# Altium project cell_adapter.PrjPcb
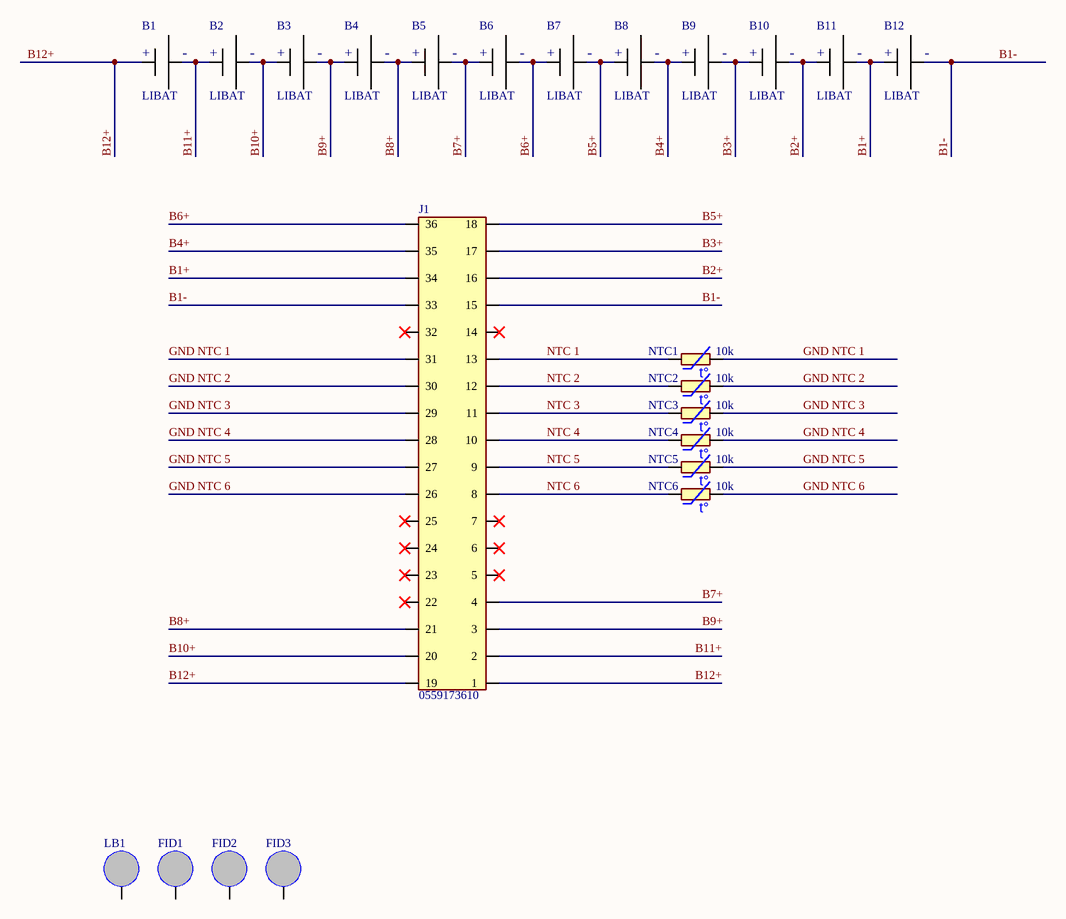
[diagram p0: cell_adapter.SchDoc]
1 sheet, 23 parts. Net scope: global (net labels, ports and power ports of the same name join across sheets).
Board file: cell_adapter.PcbDoc

## Sheet cell_adapter.SchDoc
size A4; SheetNumber: 1; SheetTotal: 1

### Parts
B1  LIBAT  [Li-BATTERY]
B2  LIBAT  [Li-BATTERY]
B3  LIBAT  [Li-BATTERY]
B4  LIBAT  [Li-BATTERY]
B5  LIBAT  [Li-BATTERY]
B6  LIBAT  [Li-BATTERY]
B7  LIBAT  [Li-BATTERY]
B8  LIBAT  [Li-BATTERY]
B9  LIBAT  [Li-BATTERY]
B10  LIBAT  [Li-BATTERY]
B11  LIBAT  [Li-BATTERY]
B12  LIBAT  [Li-BATTERY]
FID1  PE PAD  [FIDUCIAL]  (value not drawn)
FID2  PE PAD  [FIDUCIAL]  (value not drawn)
FID3  PE PAD  [FIDUCIAL]  (value not drawn)
J1  0559173610  [MICROFIT 36 VER]
LB1  PE PAD  [FIDUCIAL]  (value not drawn)
NTC1  10k  [NTC0805-HC]
NTC2  10k  [NTC0805-HC]
NTC3  10k  [NTC0805-HC]
NTC4  10k  [NTC0805-HC]
NTC5  10k  [NTC0805-HC]
NTC6  10k  [NTC0805-HC]

### Nets
B1+: B11.2 B12.1 J1.34
B1-: B12.2 J1.15 J1.33
B2+: B10.2 B11.1 J1.16
B3+: B9.2 B10.1 J1.17
B4+: B8.2 B9.1 J1.35
B5+: B7.2 B8.1 J1.18
B6+: B6.2 B7.1 J1.36
B7+: B5.2 B6.1 J1.4
B8+: B4.2 B5.1 J1.21
B9+: B3.2 B4.1 J1.3
B10+: B2.2 B3.1 J1.20
B11+: B1.2 B2.1 J1.2
B12+: B1.1 J1.1 J1.19
GND NTC 1: J1.31 NTC1.2
GND NTC 2: J1.30 NTC2.2
GND NTC 3: J1.29 NTC3.2
GND NTC 4: J1.28 NTC4.2
GND NTC 5: J1.27 NTC5.2
GND NTC 6: J1.26 NTC6.2
NTC 1: J1.13 NTC1.1
NTC 2: J1.12 NTC2.1
NTC 3: J1.11 NTC3.1
NTC 4: J1.10 NTC4.1
NTC 5: J1.9 NTC5.1
NTC 6: J1.8 NTC6.1

Not connected (* = marked no-connect by the designer): FID1 1; FID2 1; FID3 1; J1 5* 6* 7* 14* 22* 23* 24* 25* 32*; LB1 1

### Notes on the sheet
- Title:
- Size:
- Drawn By:
- Page Contents:
- Number:
- Checked By:
- Revision:
- Date:
- License:
- Email:
- Time:
- Sheet
- Website:
- of
- (in symbol LI-BATTERY) +; -
- (in symbol NTCS0805E3103FLT) t°

### Library data of the parts
B1-B12 = LI-BATTERY
FID1-FID3 LB1 = PE PAD: FIDUCIAL
J1 = Header 18X2: CONN HEADER VERT 36POS 2MM; Manufacturer_Name: Molex; Datasheet Link: https://www.molex.com/en-us/products/part-detail-pdf/559173610?display=pdf; Height: 9.95mm; Manufacturer_Part_Number: 0559173610
NTC1-NTC6 = NTCS0805E3103FLT: THERMISTOR NTC 10KOHM 3430K 0805; Manufacturer_Name: Vishay; Datasheet Link: http://www.vishay.com/docs/29044/ntcs0805e3t.pdf; Height: 0.95mm; Manufacturer_Part_Number: NTCS0805E3103FLT; Mouser Part Number: 594-NTCS0805E3103FLT; Mouser Price/Stock: https://www.mouser.co.uk/ProductDetail/Vishay-BC-Components/NTCS0805E3103FLT?qs=%2FWiulJ9oly4Pd4lidS66Yw%3D%3D; Arrow Part Number: NTCS0805E3103FLT; Arrow Price/Stock: https://www.arrow.com/en/products/ntcs0805e3103flt/vishay